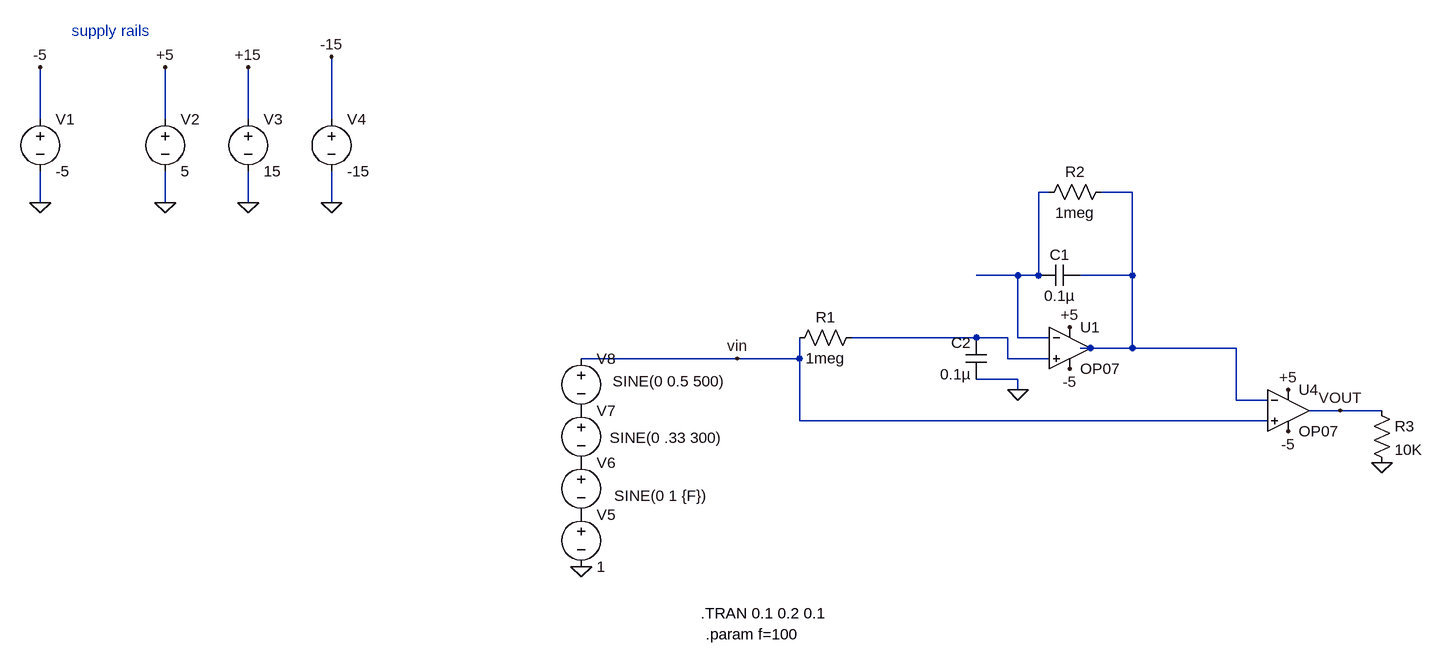
[diagram p0: schematic integrating_schmidt.asc]
integrating_schmidt.asc, the LTspice schematic file:
Version 4
SHEET 1 1092 680
WIRE -1040 -208 -1040 -288
WIRE -848 -208 -848 -288
WIRE -720 -208 -720 -288
WIRE -592 -208 -592 -304
WIRE 512 -96 496 -96
WIRE 640 -96 592 -96
WIRE -1040 -80 -1040 -128
WIRE -848 -80 -848 -128
WIRE -720 -80 -720 -128
WIRE -592 -80 -592 -128
WIRE 464 32 400 32
WIRE 496 32 496 -96
WIRE 496 32 464 32
WIRE 640 32 640 -96
WIRE 640 32 560 32
WIRE 400 128 208 128
WIRE 448 128 400 128
WIRE 464 128 464 32
WIRE 512 128 464 128
WIRE 576 144 560 144
WIRE 640 144 640 32
WIRE 640 144 576 144
WIRE 800 144 640 144
WIRE 32 160 -208 160
WIRE 128 160 128 128
WIRE 128 160 32 160
WIRE 448 160 448 128
WIRE 512 160 448 160
WIRE 464 192 400 192
WIRE 464 208 464 192
WIRE 800 224 800 144
WIRE 848 224 800 224
WIRE 960 240 912 240
WIRE 1024 240 960 240
WIRE 128 256 128 160
WIRE 848 256 128 256
FLAG -848 -288 +5
FLAG -1040 -288 -5
FLAG -848 -80 0
FLAG -1040 -80 0
FLAG -720 -80 0
FLAG -592 -80 0
FLAG -720 -288 +15
FLAG -592 -304 -15
FLAG 880 208 +5
FLAG 880 272 -5
FLAG -208 480 0
FLAG 1024 320 0
FLAG 960 240 VOUT
FLAG 464 208 0
FLAG 32 160 vin
FLAG 544 112 +5
FLAG 544 176 -5
SYMBOL voltage -1040 -224 R0
SYMATTR InstName V1
SYMATTR Value -5
SYMBOL voltage -848 -224 R0
SYMATTR InstName V2
SYMATTR Value 5
SYMBOL voltage -720 -224 R0
SYMATTR InstName V3
SYMATTR Value 15
SYMBOL voltage -592 -224 R0
SYMATTR InstName V4
SYMATTR Value -15
SYMBOL Opamps/OP07 880 176 R0
SYMATTR InstName U4
SYMBOL voltage -208 384 R0
SYMATTR InstName V5
SYMATTR Value 1
SYMBOL voltage -208 304 R0
WINDOW 3 51 67 Left 2
SYMATTR InstName V6
SYMATTR Value SINE(0 1 {F})
SYMBOL voltage -208 224 R0
WINDOW 3 44 58 Left 2
SYMATTR InstName V7
SYMATTR Value SINE(0 .33 300)
SYMBOL voltage -208 144 R0
WINDOW 3 49 51 Left 2
SYMATTR InstName V8
SYMATTR Value SINE(0 0.5 500)
SYMBOL res 1008 224 R0
SYMATTR InstName R3
SYMATTR Value 10K
SYMBOL Opamps/OP07 544 80 R0
SYMATTR InstName U1
SYMBOL cap 560 16 R90
WINDOW 0 0 32 VBottom 2
WINDOW 3 32 32 VTop 2
SYMATTR InstName C1
SYMATTR Value 0.1µ
SYMBOL res 224 112 R90
WINDOW 0 0 56 VBottom 2
WINDOW 3 32 56 VTop 2
SYMATTR InstName R1
SYMATTR Value 1meg
SYMBOL res 608 -112 R90
WINDOW 0 0 56 VBottom 2
WINDOW 3 32 56 VTop 2
SYMATTR InstName R2
SYMATTR Value 1meg
SYMBOL cap 416 192 R180
WINDOW 0 24 56 Left 2
WINDOW 3 24 8 Left 2
SYMATTR InstName C2
SYMATTR Value 0.1µ
TEXT -992 -344 Left 2 ;supply rails
TEXT -24 552 Left 2 !.TRAN 0.1 0.2 0.1
TEXT -16 584 Left 2 !.param f=100

The netlist it stands for:
* integrating_schmidt.asc
V1 -5 0 -5
V2 +5 0 5
V3 +15 0 15
V4 -15 0 -15
XU4 vin N002 +5 -5 VOUT LT1001  ; OP07, pins In+ In- V+ V- OUT
V5 P001 0 1
V6 P002 P001 SINE(0 1 {F})
V7 P003 P002 SINE(0 .33 300)
V8 vin P003 SINE(0 0.5 500)
R3 VOUT 0 10K
XU1 N003 N001 +5 -5 N002 LT1001  ; OP07, pins In+ In- V+ V- OUT
C1 N002 N001 0.1µ
R1 N003 vin 1meg
R2 N002 N001 1meg
C2 0 N003 0.1µ
* supply rails
.TRAN 0.1 0.2 0.1
.param f=100
.lib LTC.lib
.backanno
.end